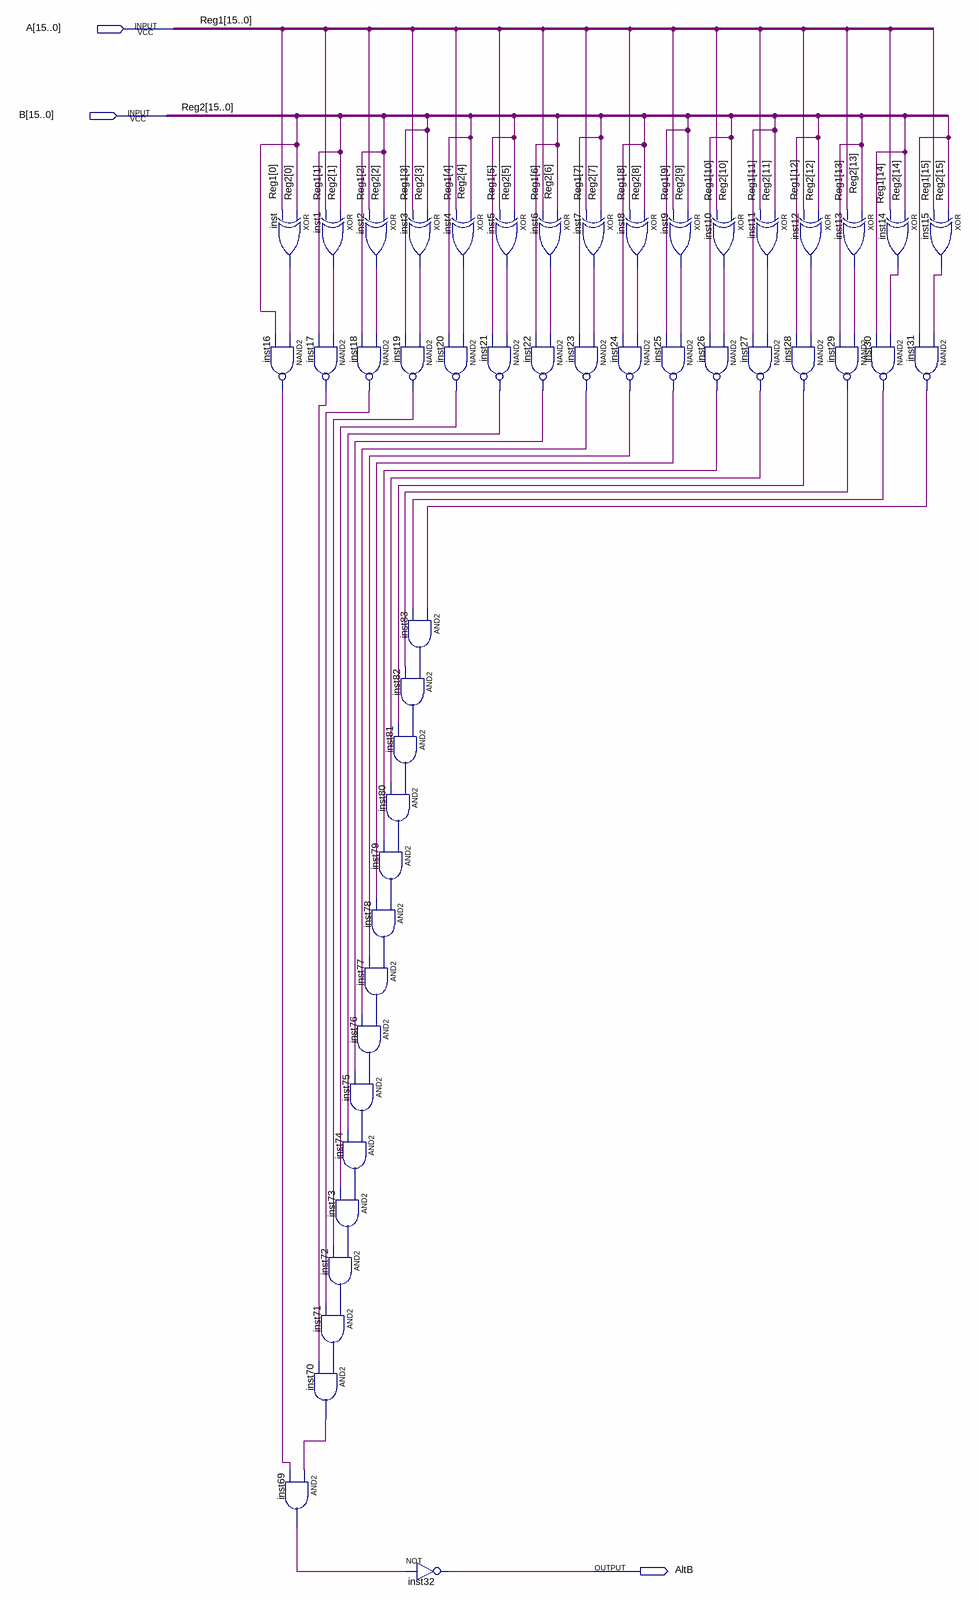
[diagram p0: schematic sheet]
// Quartus schematic ALTB.bdf as structural Verilog: 48 symbols, 3 pins
module ALTB (
  input  [15:0] A,
  input  [15:0] B,
  output AltB
);

  wire inst1_out, inst2_out, inst3_out, inst4_out, inst5_out, inst6_out, inst7_out, inst8_out, inst9_out,
       inst10_out, inst11_out, inst12_out, inst13_out, inst14_out, inst15_out, inst16_out, inst17_out,
       inst18_out, inst19_out, inst20_out, inst21_out, inst22_out, inst23_out, inst24_out, inst25_out,
       inst26_out, inst27_out, inst28_out, inst29_out, inst30_out, inst31_out, inst69_out, inst70_out,
       inst71_out, inst72_out, inst73_out, inst74_out, inst75_out, inst76_out, inst77_out, inst78_out,
       inst79_out, inst80_out, inst81_out, inst82_out, inst83_out, inst_out;

  xor inst (inst_out, B[0], A[0]);
  nand inst16 (inst16_out, inst_out, B[0]);
  and inst69 (inst69_out, inst70_out, inst16_out);
  xor inst1 (inst1_out, B[1], A[1]);
  xor inst2 (inst2_out, B[2], A[2]);
  nand inst17 (inst17_out, inst1_out, B[1]);
  nand inst18 (inst18_out, inst2_out, B[2]);
  and inst77 (inst77_out, inst78_out, inst24_out);
  and inst76 (inst76_out, inst77_out, inst23_out);
  and inst75 (inst75_out, inst76_out, inst22_out);
  and inst74 (inst74_out, inst75_out, inst21_out);
  and inst73 (inst73_out, inst74_out, inst20_out);
  and inst72 (inst72_out, inst73_out, inst19_out);
  and inst71 (inst71_out, inst72_out, inst18_out);
  and inst70 (inst70_out, inst71_out, inst17_out);
  xor inst3 (inst3_out, B[3], A[3]);
  nand inst19 (inst19_out, inst3_out, B[3]);
  and inst83 (inst83_out, inst31_out, inst30_out);
  and inst82 (inst82_out, inst83_out, inst29_out);
  and inst81 (inst81_out, inst82_out, inst28_out);
  and inst80 (inst80_out, inst81_out, inst27_out);
  and inst79 (inst79_out, inst80_out, inst26_out);
  and inst78 (inst78_out, inst79_out, inst25_out);
  not inst32 (AltB, inst69_out);
  xor inst4 (inst4_out, B[4], A[4]);
  nand inst20 (inst20_out, inst4_out, B[4]);
  xor inst5 (inst5_out, B[5], A[5]);
  xor inst6 (inst6_out, B[6], A[6]);
  nand inst21 (inst21_out, inst5_out, B[5]);
  nand inst22 (inst22_out, inst6_out, B[6]);
  xor inst7 (inst7_out, B[7], A[7]);
  nand inst23 (inst23_out, inst7_out, B[7]);
  xor inst8 (inst8_out, B[8], A[8]);
  nand inst24 (inst24_out, inst8_out, B[8]);
  xor inst9 (inst9_out, B[9], A[9]);
  xor inst10 (inst10_out, B[10], A[10]);
  nand inst25 (inst25_out, inst9_out, B[9]);
  nand inst26 (inst26_out, inst10_out, B[10]);
  xor inst11 (inst11_out, B[11], A[11]);
  nand inst27 (inst27_out, inst11_out, B[11]);
  xor inst12 (inst12_out, B[12], A[12]);
  nand inst28 (inst28_out, inst12_out, B[12]);
  xor inst13 (inst13_out, B[13], A[13]);
  xor inst14 (inst14_out, B[14], A[14]);
  nand inst29 (inst29_out, inst13_out, B[13]);
  nand inst30 (inst30_out, inst14_out, B[14]);
  xor inst15 (inst15_out, B[15], A[15]);
  nand inst31 (inst31_out, inst15_out, B[15]);

  // Other names for the same wires on the sheet: Reg1[15:0] = A; Reg2[15:0] = B
endmodule
